# EAGLE design VEST (EAGLE 9.6.2)
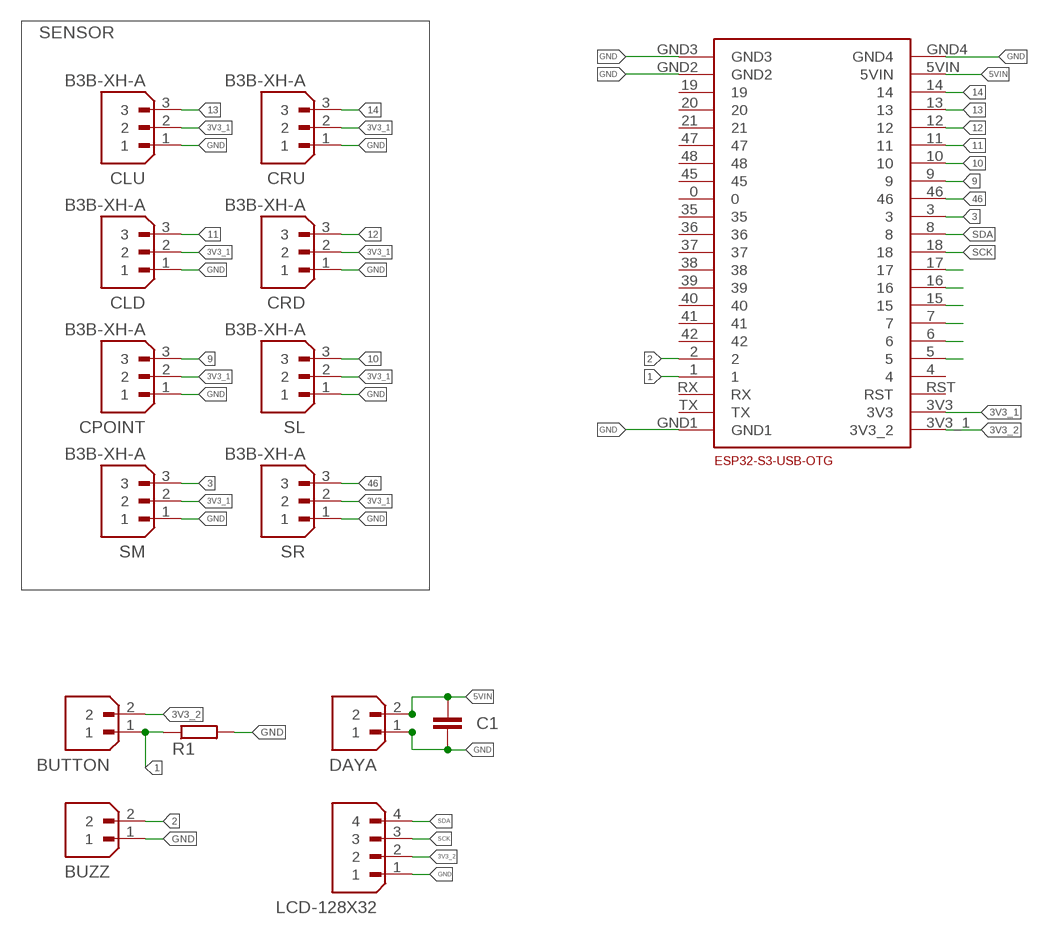
[diagram p0: schematic, sheet 1]

## Parts
BUTTON  B2B-XH-A  [JST_B2B-XH-A]
BUZZ  B2B-XH-A  [JST_B2B-XH-A]
C1  C-EUC1206  [C1206]
CLD  B3B-XH-A  [JST_B3B-XH-A]
CLU  B3B-XH-A  [JST_B3B-XH-A]
CPOINT  B3B-XH-A  [JST_B3B-XH-A]
CRD  B3B-XH-A  [JST_B3B-XH-A]
CRU  B3B-XH-A  [JST_B3B-XH-A]
DAYA  B2B-XH-A  [JST_B2B-XH-A]
LCD-128X32  B4B-XH-A(LF)(SN)  [JST_B4B-XH-A(LF)(SN)]
R1  R-EU_0207/10  [0207/10]
SL  B3B-XH-A  [JST_B3B-XH-A]
SM  B3B-XH-A  [JST_B3B-XH-A]
SR  B3B-XH-A  [JST_B3B-XH-A]
U$1  ESP32-S3-DEVKIT  [ESP32-S3-DEVKIT-USB-OTG]

## Nets
1: BUTTON.1 R1.1 U$1.1
2: BUZZ.2 U$1.2
3: SM.3 U$1.3
3V3_1: CLD.2 CLU.2 CPOINT.2 CRD.2 CRU.2 SL.2 SM.2 SR.2 U$1.3V3
3V3_2: BUTTON.2 LCD-128X32.2 U$1.3V3_1(3V3_2)
5VIN: C1.1 DAYA.2 U$1.5VIN
9: CPOINT.3 U$1.9
10: SL.3 U$1.10
11: CLD.3 U$1.11
12: CRD.3 U$1.12
13: CLU.3 U$1.13
14: CRU.3 U$1.14
46: SR.3 U$1.46
GND: BUZZ.1 C1.2 CLD.1 CLU.1 CPOINT.1 CRD.1 CRU.1 DAYA.1 LCD-128X32.1 R1.2 SL.1 SM.1 SR.1 U$1.GND1 U$1.GND2 U$1.GND3 U$1.GND4
N$9: U$1.17
N$10: U$1.16
N$11: U$1.15
N$12: U$1.7
N$13: U$1.6
N$14: U$1.5
SCK: LCD-128X32.3 U$1.18
SDA: LCD-128X32.4 U$1.8
Unconnected: U$1.0 U$1.4 U$1.19 U$1.20 U$1.21 U$1.35 U$1.36 U$1.37 U$1.38 U$1.39 U$1.40 U$1.41 U$1.42 U$1.45 U$1.47 U$1.48 U$1.RST U$1.RX U$1.TX

## Notes on the sheet
- SENSOR

## Library data of the parts
BUTTON BUZZ DAYA = B2B-XH-A:B2B-XH-A: Check availability <https://pricing.snapeda.com/parts/B2B-XH-A/JST%20Sales/view-part?ref=eda>; AVAILABILITY: In Stock; CHECK_PRICES: https://www.snapeda.com/parts/B2B-XH-A/JST/view-part/?ref=eda; DESCRIPTION: Connector Header Through Hole 2 position 0.098 (2.50mm); MF: JST Sales; MP: B2B-XH-A; PACKAGE: None; PRICE: None; SNAPEDA_LINK: https://www.snapeda.com/parts/B2B-XH-A/JST/view-part/?ref=snap
C1 = rcl:C-EU: CAPACITOR, European symbol; SPICEPREFIX: C
CLD CLU CPOINT CRD CRU SL SM SR = B3B-XH-A:B3B-XH-A: Check availability <https://pricing.snapeda.com/parts/B3B-XH-A/JST%20Sales/view-part?ref=eda>; AVAILABILITY: In Stock; CHECK_PRICES: https://www.snapeda.com/parts/B3B-XH-A/JST/view-part/?ref=eda; DESCRIPTION: Connector Header Through Hole 3 position 0.098 (2.50mm); MF: JST Sales; MP: B3B-XH-A; PACKAGE: None; PRICE: None; SNAPEDA_LINK: https://www.snapeda.com/parts/B3B-XH-A/JST/view-part/?ref=snap
LCD-128X32 = B4B-XH-A_LF__SN_:B4B-XH-A(LF)(SN): Check availability <https://pricing.snapeda.com/parts/B4B-XH-A%20%28LF%29%28SN%29/JST%20Sales/view-part?ref=eda>; AVAILABILITY: In Stock; CHECK_PRICES: https://www.snapeda.com/parts/B4B-XH-A%20(LF)(SN)/JST/view-part/?ref=eda; DESCRIPTION: Connector Header Through Hole 4 position 0.098 (2.50mm); MF: JST Sales; MP: B4B-XH-A (LF)(SN); PACKAGE: None; PRICE: None; SNAPEDA_LINK: https://www.snapeda.com/parts/B4B-XH-A%20(LF)(SN)/JST/view-part/?ref=snap
R1 = rcl:R-EU_: RESISTOR, European symbol; SPICEPREFIX: R
U$1 = esp32-s3-usb-otg:ESP32-S3-DEVKIT

## Board
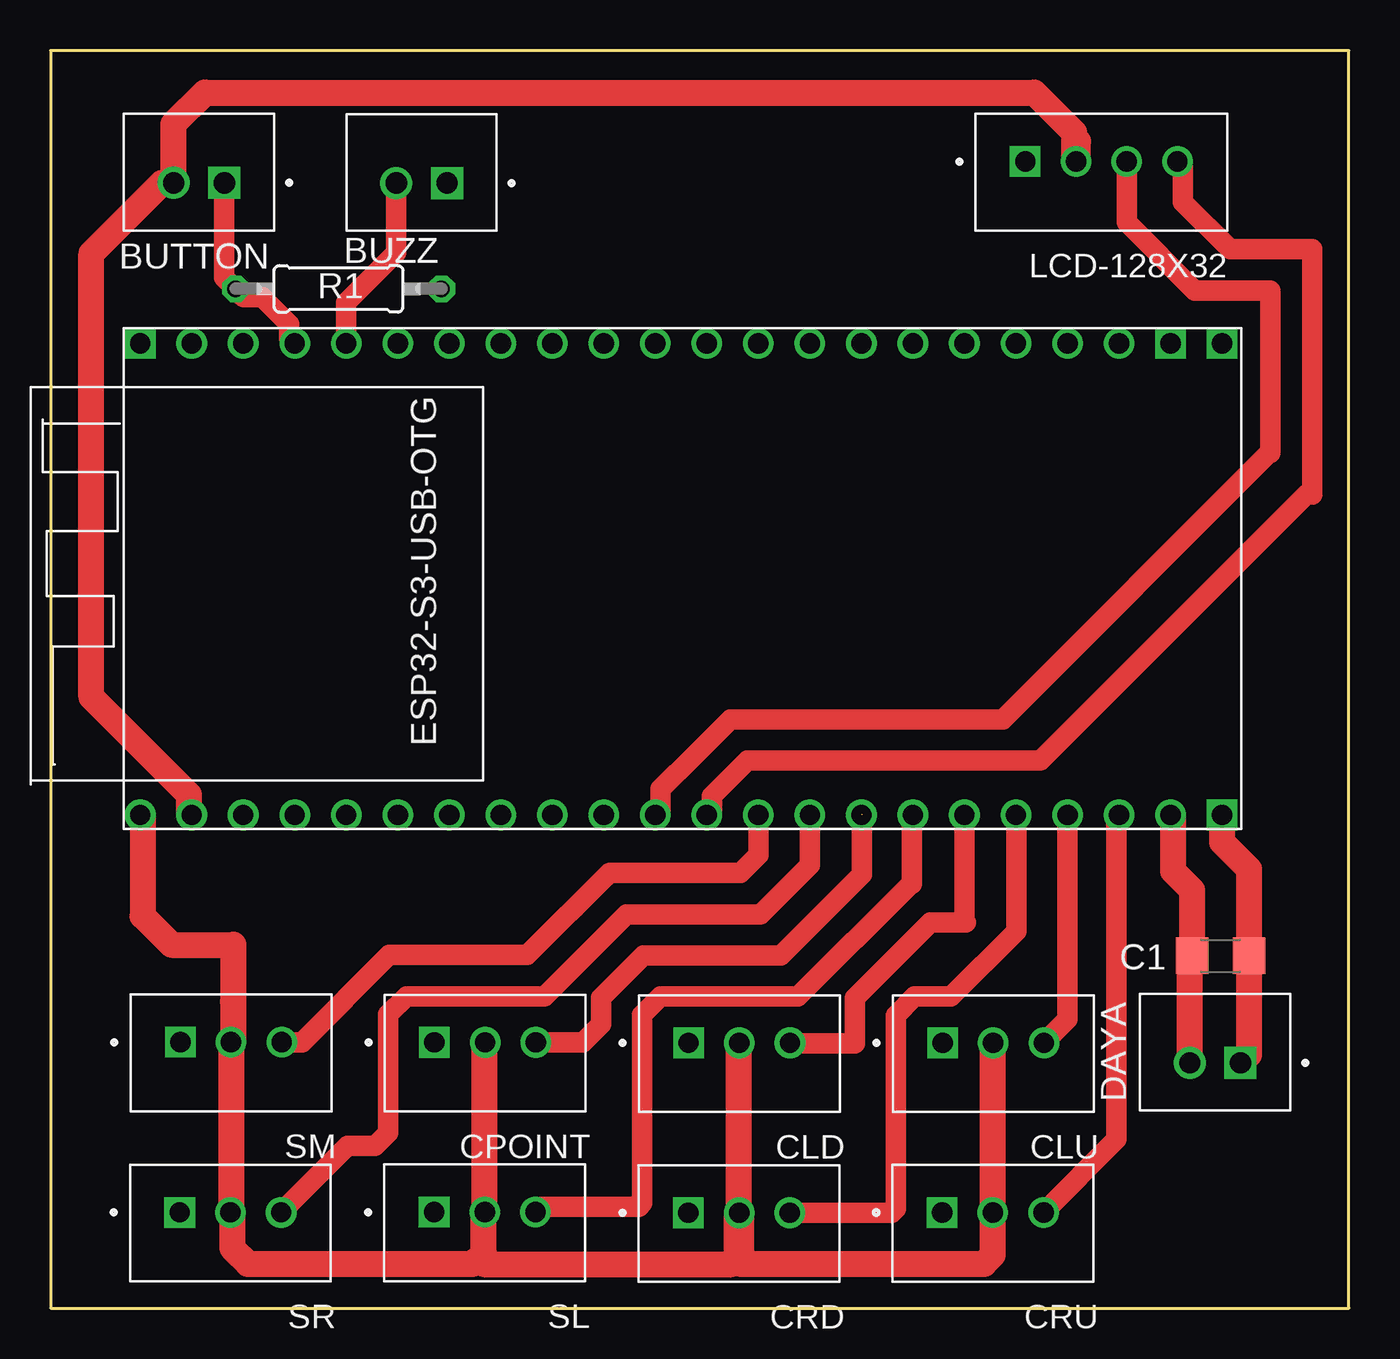
[diagram p1: board, top side]
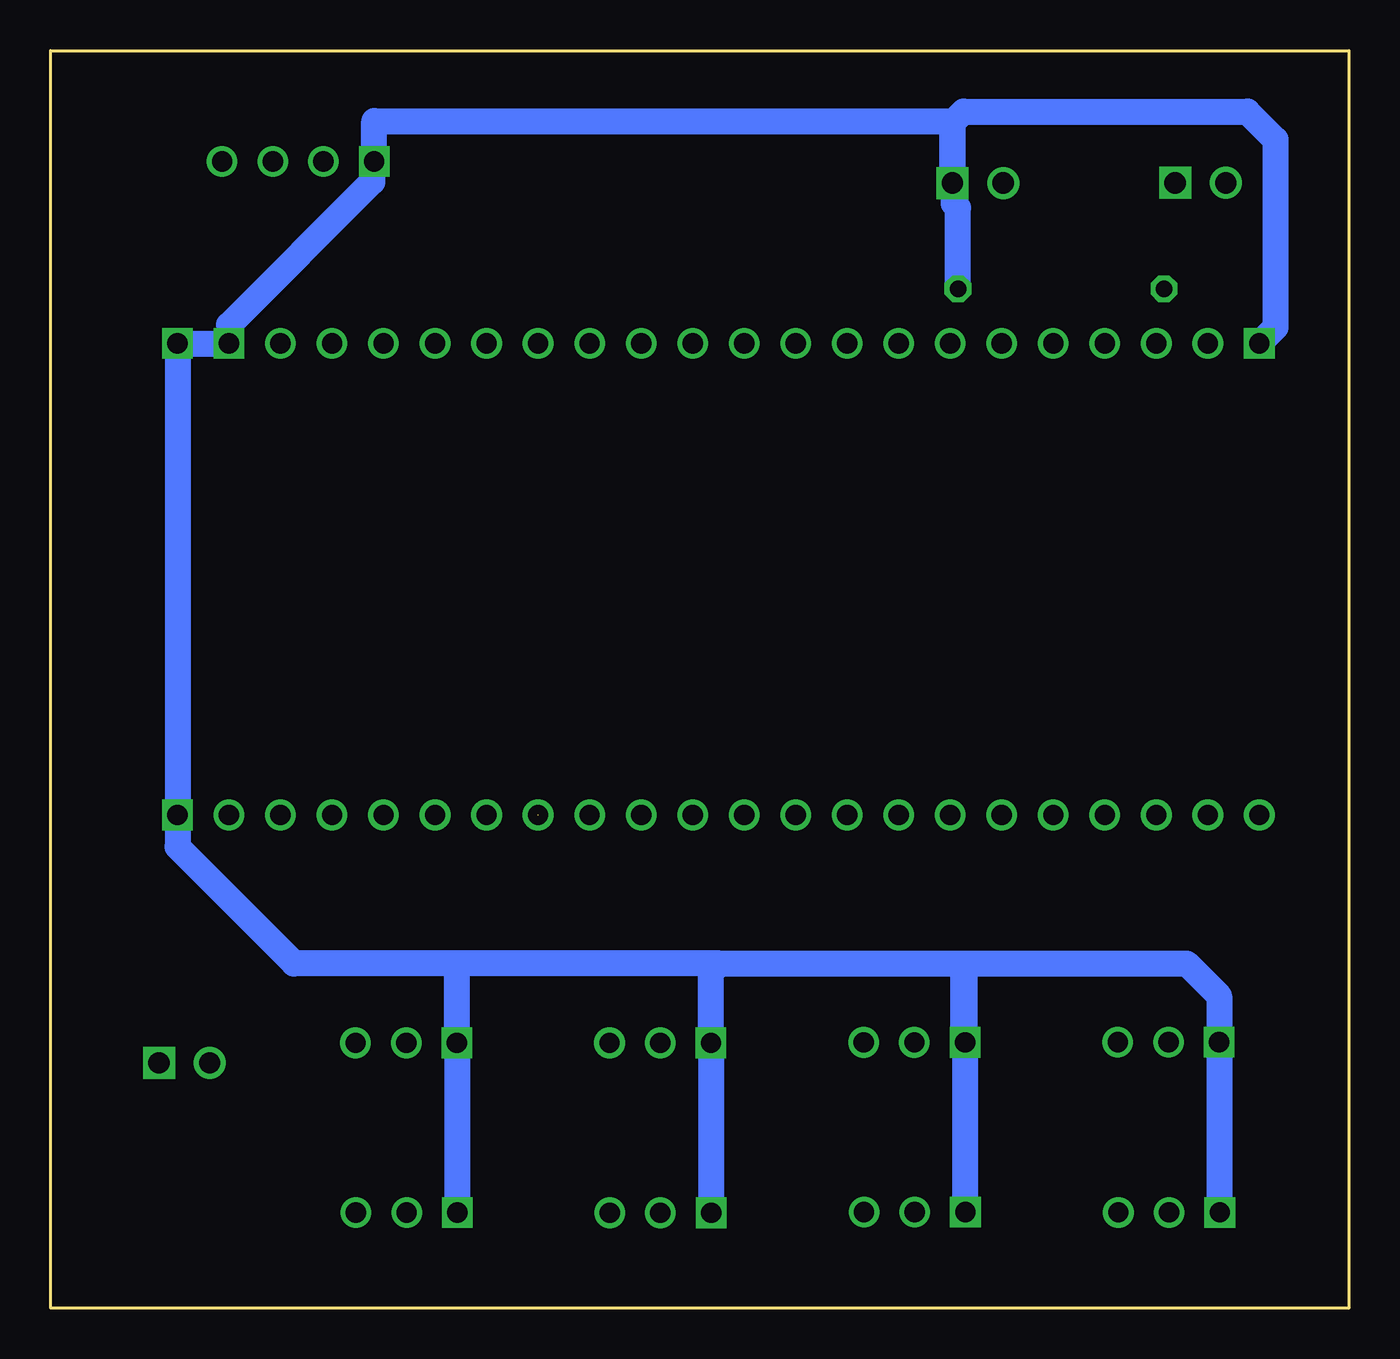
[diagram p2: board, bottom side, seen from below]

Size 64 x 62 mm. Coordinates in mm from the lower left corner, seen from the top.
Outline: 0,62 0,0 64,0 64,62 0,62
Copper layers (1*16): Top 0.035mm / dielectric 1.5mm / Bottom 0.035mm
Design rules "default *": minimum track width 40mil, minimum drill 1mm, track to track 40mil, track to pad 40mil, pad to pad 40mil, via to via 40mil, smd to smd 6mil, copper to edge 40mil, drill to drill 40mil, minimum pad ring 10mil, minimum via ring 8mil, stop-mask expansion 4mil, vias tented up to drill 0mil, thermal gap 10mil

### Footprints (pad centres in the part's own frame; a part is rotated, then mirrored left to right if it is on the bottom)
JST_B2B-XH-A = drill 1.05 square: 1 1.25,-0.525 | drill 1.05: 2 -1.25,-0.525
C1206 = smd 1.6 x 1.8: 1 -1.4,0; 2 1.4,0
JST_B3B-XH-A = drill 1 square: 1 2.5,-0.525 | drill 1: 2 0,-0.525; 3 -2.5,-0.525
JST_B4B-XH-A(LF)(SN) = drill 1 square: 1 3.75,-0.525 | drill 1: 2 1.25,-0.525; 3 -1.25,-0.525; 4 -3.75,-0.525
0207/10 = drill 0.813 octagon: 1 -5.08,0; 2 5.08,0
ESP32-S3-DEVKIT-USB-OTG = drill 1: 0 33.02,23.25; 1 7.62,23.25; 2 10.16,23.25; 3 30.48,0; 3V3 0,0; 3V3_1 2.54,0; 4 7.62,0; 5 10.16,0; 5VIN 50.8,0; 6 12.7,0; 7 15.24,0; 8 27.94,0; 9 35.56,0; 10 38.1,0; 11 40.64,0; 12 43.18,0; 13 45.72,0; 14 48.26,0; 15 17.78,0; 16 20.32,0; 17 22.86,0; 18 25.4,0; 19 48.26,23.25; 20 45.72,23.25; 21 43.18,23.25; 35 30.48,23.25; 36 27.94,23.25; 37 25.4,23.25; 38 22.86,23.25; 39 20.32,23.25; 40 17.78,23.25; 41 15.24,23.25; 42 12.7,23.25; 45 35.56,23.25; 46 33.02,0; 47 40.64,23.25; 48 38.1,23.25; RST 5.08,0; RX 5.08,23.25; TX 2.54,23.25 | drill 1 square: GND1 0,23.25; GND2 50.8,23.25; GND3 53.34,23.25; GND4 53.34,0

### Placement (x,y rotation side)
BUTTON  7.31,56.01 0 top
BUZZ  18.29,56 0 top
C1  57.68,17.38 0 top
CLD  33.95,12.56 180 top
CLU  46.47,12.56 180 top
CPOINT  21.42,12.58 180 top
CRD  33.94,4.18 180 top
CRU  46.45,4.19 180 top
DAYA  57.41,12.62 0 top
LCD-128X32  51.8,56.01 180 top
R1  14.19,50.26 0 top
SL  21.4,4.21 180 top
SM  8.89,12.59 180 top
SR  8.86,4.2 180 top
U$1  4.41,24.32 0 top

### Tracks (layer width: path | path; a pad name or v marks a point on that pad's centre or on a via)
1
  Top 1.016: BUTTON.1 8.56,50.81 R1.1 9.52,49.85 10.43,49.85 11.77,48.51 11.77,47.83 U$1.1
2
  Top 1.016: BUZZ.2 17.04,52.04 14.57,49.57 U$1.2
3
  Top 1.016: U$1.3 34.89,22.35 34,21.46 27.54,21.46 23.5,17.41 16.69,17.41 12.39,13.12 SM.3
3V3_1
  Top 1.27: U$1.3V3 4.53,24.2 4.53,19.34 5.95,17.91 9,17.91 9,15.13 8.98,15.11 8.98,13.21 SM.2 8.89,4.76 SR.2 8.96,4.63 8.96,2.96 8.95,2.96 9.73,2.18 20.8,2.18 21.3,2.69 | 21.3,2.69 21.3,4.64 SL.2 21.4,13.09 CPOINT.2 | 21.3,2.69 21.36,2.74 21.36,2.17 33.57,2.17 33.84,2.45 33.84,4.7 CRD.2 | CRD.2 33.94,13.08 CLD.2 | CRD.2 34.03,4.61 34.03,2.19 46.01,2.19 46.45,2.63 CRU.2 46.45,13.06 CLU.2
3V3_2
  Top 1.27: U$1.3V3_1 6.82,24.45 6.82,25.32 2,30.13 2,52 5.49,55.48 BUTTON.2 6.06,58.39 7.61,59.94 48.49,59.94 50.45,57.97 50.45,56.63 LCD-128X32.2 50.65,56.63 50.65,57.53
5VIN
  Top 1.27: DAYA.2 56.16,17.26 C1.1 56.28,20.61 55.34,21.54 55.34,24.19 U$1.5VIN
9  (1 unrouted)
  Top 1.016: CPOINT.3 26.23,13.1 27.13,14 27.13,15.3 29.22,17.4 36,17.4 40,21.4 40,24.34
10
  Top 1.016: SL.3 24.16,5 29,5 29.16,5.16 29.16,14.46 30.07,15.36 36.84,15.36 42.4,20.93 42.46,20.93 42.46,24.27 U$1.10
11
  Top 1.016: U$1.11 45.05,19.09 45.13,19.02 43.36,19.02 39.64,15.29 39.64,13.06 36.48,13.06 CLD.3
12
  Top 1.016: CRD.3 41.47,4.7 41.67,4.91 41.67,14.45 42.59,15.36 44.38,15.36 47.61,18.59 47.61,24.21 47.59,24.23 U$1.12
13
  Top 1.016: CLU.3 50.13,14.24 U$1.13
14
  Top 1.016: CRU.3 52.55,8.31 52.55,24.2 U$1.14
46
  Top 1.016: SR.3 14.63,8 16,8 16.64,8.64 16.64,14.49 17.54,15.38 24.34,15.38 28.38,19.43 35,19.43 37.43,21.86 U$1.46
GND
  Top 1.27: U$1.GND4 57.75,22.98 59.08,21.65 C1.2 59.08,12.52 DAYA.1
  Bottom 1.27: LCD-128X32.1 48.15,56.63 | 31,17 44,17 | 44,17 52,17 57.75,22.75 U$1.GND4 U$1.GND3 U$1.GND2 55.21,48.47 48.15,55.54 48.15,56.44 LCD-128X32.1 | CRD.1 31.45,4.72 CLD.1 31.45,16.55 31,17 | CPOINT.1 19.02,13.2 19.02,17 31,17 | CPOINT.1 18.92,4.76 SL.1 | CPOINT.1 18.92,16.99 7.99,16.99 6.39,15.39 SM.1 6.39,4.76 SR.1 | LCD-128X32.1 48.05,58.53 19.54,58.53 BUZZ.1 | BUZZ.1 19.54,58.46 19,59 5,59 3.62,57.62 3.62,48.36 U$1.GND1 | R1.2 19.27,54.26 19.48,54.47 19.48,55.41 BUZZ.1 | 44,17 44,13.12 CLU.1 43.97,4.73 CRU.1
SCK
  Top 1.016: LCD-128X32.3 53.05,53.53 56.41,50.17 60.12,50.17 60.12,42.15 60.07,42.15 46.95,29.03 33.51,29.03 31.74,27.26 30.07,25.6 30.07,24.58 U$1.18
SDA
  Top 1.016: U$1.8 32.61,24.58 32.61,25.26 34.35,27 48.79,27 61.91,40.12 62.21,40.12 62.21,52.2 58.16,52.2 55.83,54.53 55.83,56.26 LCD-128X32.4